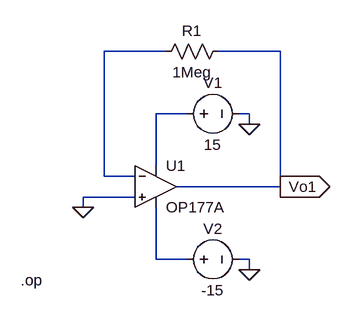
[diagram p0: schematic Run_2_B.asc]
Run_2_B.asc, the LTspice schematic file:
Version 4
SHEET 1 880 680
WIRE 256 -64 160 -64
WIRE 432 -64 336 -64
WIRE 288 32 240 32
WIRE 384 32 368 32
WIRE 384 48 384 32
WIRE 240 112 240 32
WIRE 160 128 160 -64
WIRE 208 128 160 128
WIRE 432 144 432 -64
WIRE 432 144 272 144
WIRE 208 160 128 160
WIRE 128 176 128 160
WIRE 240 256 240 176
WIRE 288 256 240 256
WIRE 384 256 368 256
WIRE 384 272 384 256
FLAG 384 48 0
FLAG 384 272 0
FLAG 432 144 Vo1
IOPIN 432 144 Out
FLAG 128 176 0
SYMBOL OpAmps\\OP177A 240 80 R0
SYMATTR InstName U1
SYMBOL voltage 272 32 R270
WINDOW 0 32 56 VTop 2
WINDOW 3 -32 56 VBottom 2
WINDOW 123 0 0 Left 0
WINDOW 39 0 0 Left 0
SYMATTR InstName V1
SYMATTR Value 15
SYMBOL voltage 272 256 R270
WINDOW 0 32 56 VTop 2
WINDOW 3 -32 56 VBottom 2
WINDOW 123 0 0 Left 0
WINDOW 39 0 0 Left 0
SYMATTR InstName V2
SYMATTR Value -15
SYMBOL res 352 -80 R90
WINDOW 0 0 56 VBottom 2
WINDOW 3 32 56 VTop 2
SYMATTR InstName R1
SYMATTR Value 1Meg
TEXT 32 288 Left 2 !.op

The netlist it stands for:
* Run_2_B.asc
XU1 0 N001 N002 N003 Vo1 OP177A  ; pins In+ In- V+ V- OUT
V1 N002 0 15
V2 N003 0 -15
R1 Vo1 N001 1Meg
.op
.backanno
.end